# EAGLE schematic Beacon_bk (EAGLE 6.1)
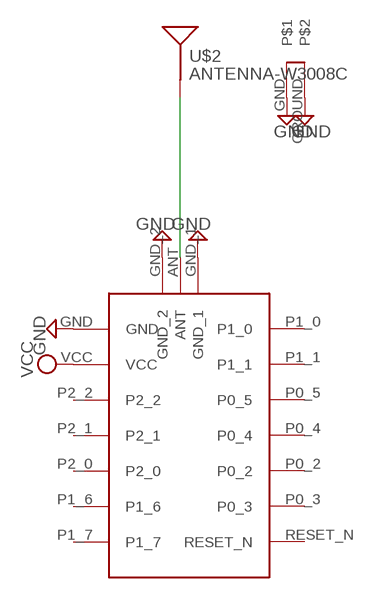
[diagram p0: schematic, sheet 1]

## Parts
U$1  BLE4  [BLE4]
U$2  ANTENNA-W3008C  [ANTENNA-W3008C]

## Nets
GND: U$1.GND U$1.GND_1 U$1.GND_2 U$2.GND U$2.GROUND
N$1: U$1.ANT U$2.FEED(SIGNAL)
VCC: U$1.VCC
Unconnected: U$1.P0_2 U$1.P0_3 U$1.P0_4 U$1.P0_5 U$1.P1_0 U$1.P1_1 U$1.P1_6 U$1.P1_7 U$1.P2_0 U$1.P2_1 U$1.P2_2 U$1.RESET_N

## Library data of the parts
U$1 = foxkn:BLE4
U$2 = SparkFun-RF:ANTENNA-W3008C